# Altium schematic sheet Debug.SchDoc
size A
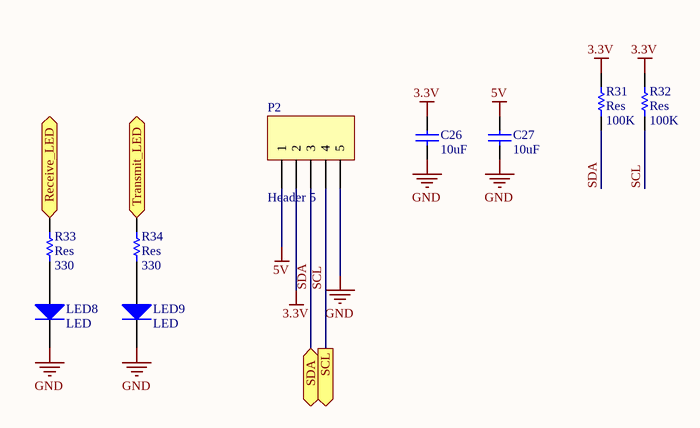
[diagram p0: Debug.SchDoc]

## Parts
C26  value 10uF  [2012[0805]]  (hidden comment: Cap_UP)
C27  value 10uF  [2012[0805]]  (hidden comment: Cap_UP)
LED8  LED  [2012[0805]]
LED9  LED  [2012[0805]]
P2  Header 5  [HDR1X5]
R31  Res  value 100K  [2012[0805]]
R32  Res  value 100K  [2012[0805]]
R33  Res  value 330  [2012[0805]]
R34  Res  value 330  [2012[0805]]

## Ports
Receive_LED (in), SCL (out), SDA (bidir), Transmit_LED (in)

## Nets
3.3V: C26.2 P2.2 R31.2 R32.2
5V: C27.2 P2.1
GND: C26.1 C27.1 LED8.2(K) LED9.2(K) P2.5
Receive_LED: R33.1 ; port Receive_LED
SCL: P2.4 R32.1 ; port SCL
SDA: P2.3 R31.1 ; port SDA
Transmit_LED: R34.1 ; port Transmit_LED
NetLED8_1: LED8.1(A) R33.2
NetLED9_1: LED9.1(A) R34.2

## Library data of the parts
C26 C27 = Cap_UP: Capacitor; Published: 8-Jun-2000; LatestRevisionDate: 17-Jul-2002; LatestRevisionNote: Re-released for DXP Platform.; PackageReference: RAD-0.3; Publisher: Altium Limited
LED8 LED9 = Diode: 1 Amp General Purpose Rectifier; Revision 1: 11-Jul-2000: SIM Model Added.; Revision 2: 17-Jul-2002: Re-released for DXP Platform.; Package Information: Latest Revision: Aug-1999; Code - JEDEC: DO-204-AL; Published: 8-Jun-2000; Datasheet: Latest Revision: 1998; Package Reference: DO-41; Publisher: Altium Limited
P2 = Header 5: Header, 5-Pin; LatestRevisionDate: 17-Jul-2002; LatestRevisionNote: Re-released for DXP Platform.; Publisher: Altium Limited
R31-R34 = Res: Semiconductor Resistor; Published: 8-Jun-2000; LatestRevisionDate: 17-Jul-2002; LatestRevisionNote: Re-released for DXP Platform.; PackageReference: AXIAL-0.5; Publisher: Altium Limited